# Altium project 1_Interface_QuadUART.PrjPCB
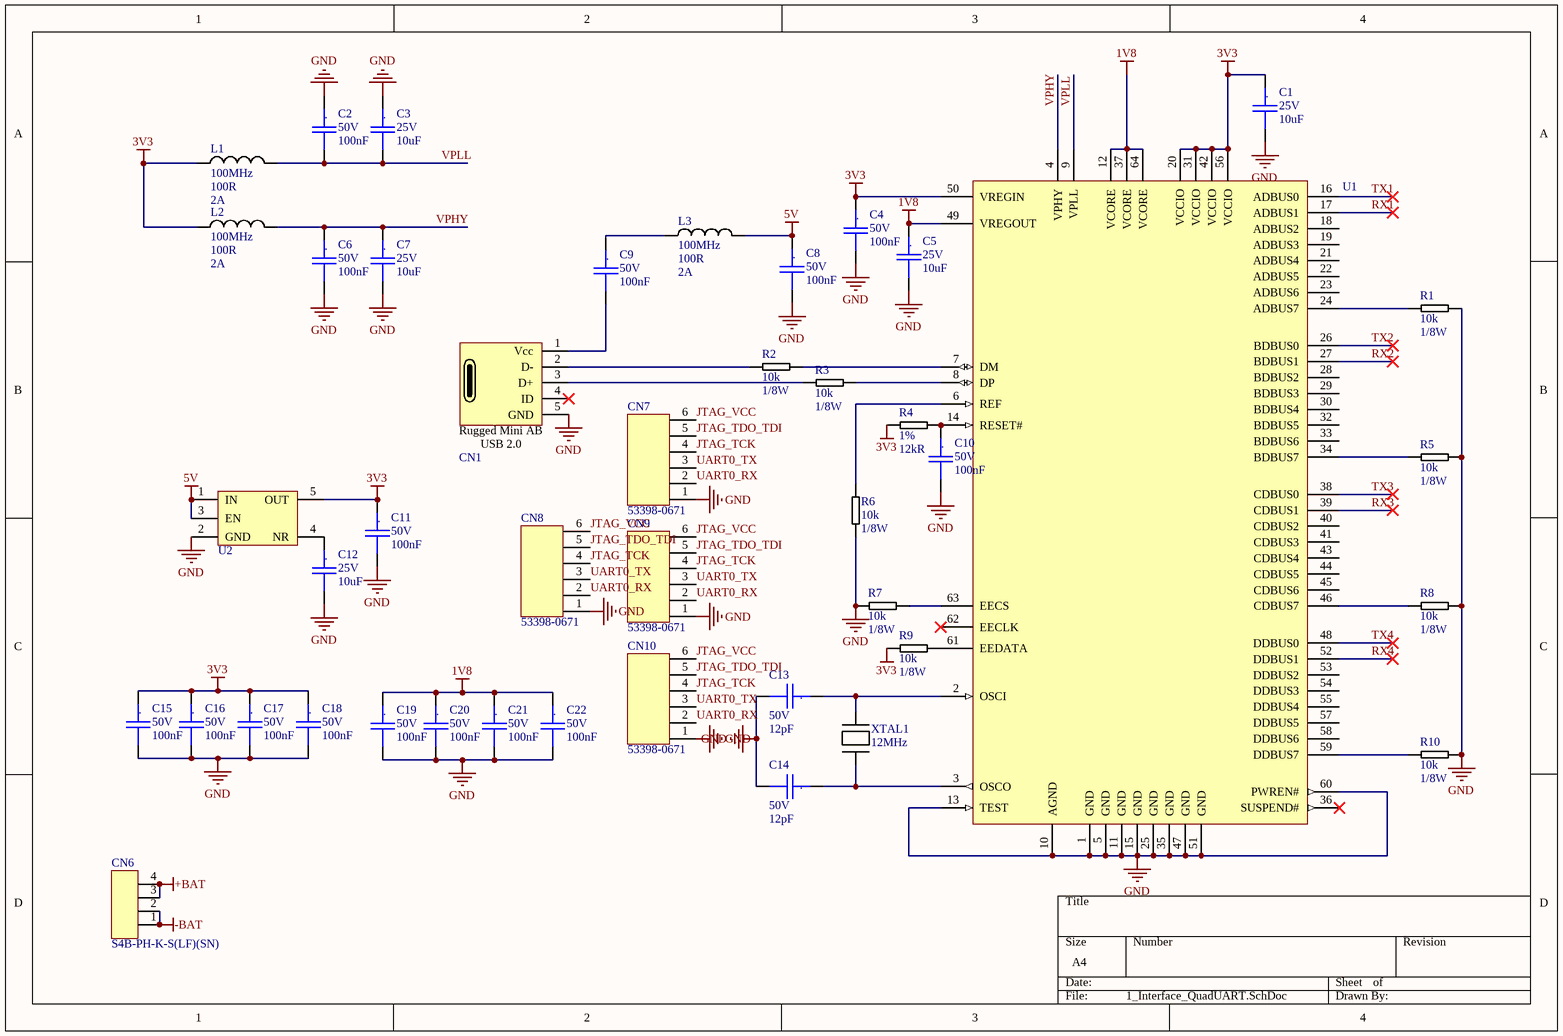
[diagram p0: 1_Interface_QuadUART.SchDoc]
1 sheet, 44 parts. Net scope: global (net labels, ports and power ports of the same name join across sheets).
Board file: 1_Interface_QuadUART.PcbDoc

## Sheet 1_Interface_QuadUART.SchDoc
size A4

### Parts
C1  Voltage: 25V  Capacitance: 10uF  [C1206_MD]  (hidden comment: GRM31CR71E106KA12K)
C2  Voltage Rating: 50V  Capacitance: 100nF  [C0603_MD]  (hidden comment: C1608X7R1H104K080AA)
C3  Voltage: 25V  Capacitance: 10uF  [C1206_MD]  (hidden comment: GRM31CR71E106KA12K)
C4  Voltage Rating: 50V  Capacitance: 100nF  [C0603_MD]  (hidden comment: C1608X7R1H104K080AA)
C5  Voltage: 25V  Capacitance: 10uF  [C1206_MD]  (hidden comment: GRM31CR71E106KA12K)
C6  Voltage Rating: 50V  Capacitance: 100nF  [C0603_MD]  (hidden comment: C1608X7R1H104K080AA)
C7  Voltage: 25V  Capacitance: 10uF  [C1206_MD]  (hidden comment: GRM31CR71E106KA12K)
C8  Voltage Rating: 50V  Capacitance: 100nF  [C0603_MD]  (hidden comment: C1608X7R1H104K080AA)
C9  Voltage Rating: 50V  Capacitance: 100nF  [C0603_MD]  (hidden comment: C1608X7R1H104K080AA)
C10  Voltage Rating: 50V  Capacitance: 100nF  [C0603_MD]  (hidden comment: C1608X7R1H104K080AA)
C11  Voltage Rating: 50V  Capacitance: 100nF  [C0603_MD]  (hidden comment: C1608X7R1H104K080AA)
C12  Voltage: 25V  Capacitance: 10uF  [C1206_MD]  (hidden comment: GRM31CR71E106KA12K)
C13  Voltage: 50V  Capacitance: 12pF  [C0603_MD]  (hidden comment: CL10C120JB8NNNC)
C14  Voltage: 50V  Capacitance: 12pF  [C0603_MD]  (hidden comment: CL10C120JB8NNNC)
C15  Voltage Rating: 50V  Capacitance: 100nF  [C0603_MD]  (hidden comment: C1608X7R1H104K080AA)
C16  Voltage Rating: 50V  Capacitance: 100nF  [C0603_MD]  (hidden comment: C1608X7R1H104K080AA)
C17  Voltage Rating: 50V  Capacitance: 100nF  [C0603_MD]  (hidden comment: C1608X7R1H104K080AA)
C18  Voltage Rating: 50V  Capacitance: 100nF  [C0603_MD]  (hidden comment: C1608X7R1H104K080AA)
C19  Voltage Rating: 50V  Capacitance: 100nF  [C0603_MD]  (hidden comment: C1608X7R1H104K080AA)
C20  Voltage Rating: 50V  Capacitance: 100nF  [C0603_MD]  (hidden comment: C1608X7R1H104K080AA)
C21  Voltage Rating: 50V  Capacitance: 100nF  [C0603_MD]  (hidden comment: C1608X7R1H104K080AA)
C22  Voltage Rating: 50V  Capacitance: 100nF  [C0603_MD]  (hidden comment: C1608X7R1H104K080AA)
CN1  MUSBR-E551-30  [RUGGED USB MINI AB VERTICAL]  (value not drawn)
CN6  S4B-PH-K-S(LF)(SN)  [CONN HEADER R/A 4POS 2MM]
CN7  53398-0671  [PICO BLADE 0533980671]
CN8  53398-0671  [PICO BLADE 0533980671]
CN9  53398-0671  [PICO BLADE 0533980671]
CN10  53398-0671  [PICO BLADE 0533980671]
L1  Test Frequency: 100MHz  Impedance: 100R  Current Rating: 2A  [L0603]  (hidden comment: BLM18EG101TN1D)
L2  Test Frequency: 100MHz  Impedance: 100R  Current Rating: 2A  [L0603]  (hidden comment: BLM18EG101TN1D)
L3  Test Frequency: 100MHz  Impedance: 100R  Current Rating: 2A  [L0603]  (hidden comment: BLM18EG101TN1D)
R1  value 10k  Power: 1/8W  [R0805_MD]  (hidden comment: CRCW080510K0FKEA)
R2  value 10k  Power: 1/8W  [R0805_MD]  (hidden comment: CRCW080510K0FKEA)
R3  value 10k  Power: 1/8W  [R0805_MD]  (hidden comment: CRCW080510K0FKEA)
R4  Tolerance: 1%  Resistance: 12kR  [R0805_MD]  (hidden comment: RMCF0805FT12K0)
R5  value 10k  Power: 1/8W  [R0805_MD]  (hidden comment: CRCW080510K0FKEA)
R6  value 10k  Power: 1/8W  [R0805_MD]  (hidden comment: CRCW080510K0FKEA)
R7  value 10k  Power: 1/8W  [R0805_MD]  (hidden comment: CRCW080510K0FKEA)
R8  value 10k  Power: 1/8W  [R0805_MD]  (hidden comment: CRCW080510K0FKEA)
R9  value 10k  Power: 1/8W  [R0805_MD]  (hidden comment: CRCW080510K0FKEA)
R10  value 10k  Power: 1/8W  [R0805_MD]  (hidden comment: CRCW080510K0FKEA)
U1  IC USB HS QUAD UART  [LQFP-64]  (value not drawn)
U2  TPS79333DBVR  [SOT23-5]  (value not drawn)
XTAL1  Frequency: 12MHz  [TXC 7A Series]  (hidden comment: AA-12.000MAGE-T)

### Nets
1V8: C5.1 C19.1 C20.1 C21.1 C22.1 U1.12(VCORE) U1.37(VCORE) U1.49(VREGOUT) U1.64(VCORE)
3V3: C1.1 C4.1 C11.1 C15.1 C16.1 C17.1 C18.1 L1.1 L2.1 R4.1 R9.1 U1.20(VCCIO) U1.31(VCCIO) U1.42(VCCIO) U1.50(VREGIN) U1.56(VCCIO) U2.5(OUT)
5V: C8.1 L3.2 U2.1(IN) U2.3(EN)
+BAT: CN6.3 CN6.4
-BAT: CN6.1 CN6.2
GND: C1.2 C2.1 C3.1 C4.2 C5.2 C6.2 C7.2 C8.2 C10.2 C11.2 C12.2 C13.2 C14.2 C15.2 C16.2 C17.2 C18.2 C19.2 C20.2 C21.2 C22.2 CN1.5(GND) CN7.1 CN8.1 CN9.1 CN10.1 R1.2 R5.2 R6.1 R7.1 R8.2 R10.2 U1.1(GND) U1.5(GND) U1.10(AGND) U1.11(GND) U1.13(TEST) U1.15(GND) U1.25(GND) U1.35(GND) U1.47(GND) U1.51(GND) U1.60(PWREN#) U2.2(GND)
JTAG_TCK: CN7.4 CN8.4 CN9.4 CN10.4
JTAG_TDO_TDI: CN7.5 CN8.5 CN9.5 CN10.5
JTAG_VCC: CN7.6 CN8.6 CN9.6 CN10.6
RX1: U1.17(ADBUS1)
RX2: U1.27(BDBUS1)
RX3: U1.39(CDBUS1)
RX4: U1.52(DDBUS1)
TX1: U1.16(ADBUS0)
TX2: U1.26(BDBUS0)
TX3: U1.38(CDBUS0)
TX4: U1.48(DDBUS0)
UART0_RX: CN7.2 CN8.2 CN9.2 CN10.2
UART0_TX: CN7.3 CN8.3 CN9.3 CN10.3
VPHY: C6.1 C7.1 L2.2 U1.4(VPHY)
VPLL: C2.2 C3.2 L1.2 U1.9(VPLL)
NetC9_1: C9.1 L3.1
NetC9_2: C9.2 CN1.1(Vcc)
NetC10_1: C10.1 R4.2 U1.14(RESET#)
NetC12_1: C12.1 U2.4(NR)
NetC13_1: C13.1 U1.2(OSCI) XTAL1.1
NetC14_1: C14.1 U1.3(OSCO) XTAL1.2
NetCN1_2: CN1.2(D-) R2.1
NetCN1_3: CN1.3(D+) R3.1
NetR1_1: R1.1 U1.24(ADBUS7)
NetR2_2: R2.2 U1.7(DM)
NetR3_2: R3.2 U1.8(DP)
NetR5_1: R5.1 U1.34(BDBUS7)
NetR6_2: R6.2 U1.6(REF)
NetR7_2: R7.2 U1.63(EECS)
NetR8_1: R8.1 U1.46(CDBUS7)
NetR9_2: R9.2 U1.61(EEDATA)
NetR10_1: R10.1 U1.59(DDBUS7)

Not connected (* = marked no-connect by the designer): CN1 4(ID)*; U1 18(ADBUS2) 19(ADBUS3) 21(ADBUS4) 22(ADBUS5) 23(ADBUS6) 28(BDBUS2) 29(BDBUS3) 30(BDBUS4) 32(BDBUS5) 33(BDBUS6) 36(SUSPEND#)* 40(CDBUS2) 41(CDBUS3) 43(CDBUS4) 44(CDBUS5) 45(CDBUS6) 53(DDBUS2) 54(DDBUS3) 55(DDBUS4) 57(DDBUS5) 58(DDBUS6) 62(EECLK)*

### Notes on the sheet
- (in symbol C1608X7R1H104K080AA) .
- (in symbol CL10C120JB8NNNC) .
- (in symbol GRM31CR71E106KA12K) .
- (in symbol MUSBR-E551-30) Rugged Mini AB; USB 2.0

### Library data of the parts
C1 C3 C5 C7 C12 = GRM31CR71E106KA12K: CAP CER 10UF 25V X7R 1206; Manufacturer: Murata; Tolerance: 10%; Supplier 1: Digi-Key; Supplier Part Number 1: 490-14678-1-ND; Stock 1: 11567; Pricing 1: 1=0.88, 10=0.652, 100=0.4469, 500=0.35378, 1000=0.29792, 2500=0.2793 (USD); Mount: Surface Mount; Case/Package: 1206; Min Operating Temperature: -55°C; Max Operating Temperature: 125°C; Packaging: Tape and Reel; Voltage Rating: 25V; Dielectric: X7R; Voltage Rating (DC): 25V; Length: 0.126inch; Width: 0.063inch; Thickness: 0.071inch; Lead Free: Lead Free; ComponentLink1URL: https://www.murata.com/~/media/webrenewal/support/library/catalog/products/capacitor/mlcc/c02e.ashx?la=en-us&src-supplier=Digi-Key; ComponentLink1Description: https://www.murata.com/~/media/webrenewal/support/library/catalog/products/capacitor/mlcc/c02e.ashx?la=en-us&src-supplier=Digi-Key; ComponentLink2URL: https://search.murata.co.jp/Ceramy/image/img/A01X/G101/ENG/GRM31CR71E106KA12-01.pdf?src-supplier=Digi-Key; ComponentLink2Description: https://search.murata.co.jp/Ceramy/image/img/A01X/G101/ENG/GRM31CR71E106KA12-01.pdf?src-supplier=Digi-Key; Supplier 2: Mouser; Supplier Part Number 2: 81-GRM31CR71E106KA2K; Stock 2: 5051; Pricing 2: 1=0.88, 10=0.652, 100=0.446, 250=0.446, 500=0.353, 1000=0.297 (USD); Manufacturer Part Number: GRM31CR71E106KA12K
C2 C4 C6 C8-C11 C15-C22 = C1608X7R1H104K080AA: TDK - C1608X7R1H104K080AA - SMD Multilayer Ceramic Capacitor, 0.1 µF, 50 V, 0603 [1608 Metric], ± 10%, X7R, C Series; Supplier 1: Digi-Key; Supplier Part Number 1: 445-1314-1-ND; Manufacturer: TDK; Stock 1: 513759; Pricing 1: 1=0.12, 10=0.088, 100=0.0413, 500=0.02896, 1000=0.02397 (USD); Mount: Surface Mount; Case/Package: 0603; Number of Pins: 2; Weight: 7.1E-05oz; Case Code (Imperial): 0603; Case Code (Metric): 1608; Dielectric Material: Ceramic; Min Operating Temperature: -55°C; Max Operating Temperature: 125°C; Tolerance: 10%; Dielectric: X7R; Packaging: Tape and Reel; Package Quantity: 1; Termination: SMD/SMT; Voltage: 50V; Voltage Rating (DC): 50V; Composition: Ceramic; Length: 1.6mm; Height: 0.8mm; Depth: 0.8mm; Width: 0.8mm; Thickness: 0.037inch; Radiation Hardening: No; REACH SVHC: No SVHC; Lead Free: Lead Free; ComponentLink1URL: https://product.tdk.com/info/en/catalog/spec/mlccspec_commercial_general_midvoltage_en.pdf?src-supplier=Digi-Key; ComponentLink1Description: https://product.tdk.com/info/en/catalog/spec/mlccspec_commercial_general_midvoltage_en.pdf?src-supplier=Digi-Key; ComponentLink2URL: http://uk.rs-online.com/webdocs/13d1/0900766b813d1103.pdf?src-supplier=RSComponents; ComponentLink2Description: http://uk.rs-online.com/webdocs/13d1/0900766b813d1103.pdf?src-supplier=RSComponents; ComponentLink3URL: http://www.tdk.co.jp/tefe02/e412_c.pdf?src-supplier=Avnet+Europe; ComponentLink3Description: http://www.tdk.co.jp/tefe02/e412_c.pdf?src-supplier=Avnet+Europe; ComponentLink4URL: http://www.farnell.com/datasheets/2792994.pdf?src-supplier=Farnell; ComponentLink4Description: http://www.farnell.com/datasheets/2792994.pdf?src-supplier=Farnell; ComponentLink5URL: http://www.farnell.com/datasheets/1744655.pdf?src-supplier=Element14; ComponentLink5Description: http://www.farnell.com/datasheets/1744655.pdf?src-supplier=Element14; Supplier 2: Mouser; Supplier Part Number 2: 810-C1608X7R1H104K; Stock 2: 34512; Pricing 2: 1=0.12, 10=0.088, 100=0.041, 500=0.029, 1000=0.024, 4000=0.017, 8000=0.016, 24000=0.013, 48000=0.011 (USD); Manufacturer Part Number: C1608X7R1H104K080AA
C13 C14 = CL10C120JB8NNNC: Cap Ceramic 12pF 50VDC C0G 5% SMD 0603 Paper T/R; Manufacturer: Samsung; Temperature Coefficient: 300ppm/°C; Supplier 1: Digi-Key; Supplier Part Number 1: 1276-1254-1-ND; Stock 1: 64675; Pricing 1: 1=0.1, 10=0.045, 100=0.0201, 500=0.01436, 1000=0.01128 (USD); Mount: Surface Mount; Case/Package: 0603; Case Code (Metric): 1608; Case Code (Imperial): 0603; Material: Ceramic; Contact Plating: Tin; Min Operating Temperature: -55°C; Max Operating Temperature: 125°C; Dielectric: C0G; Voltage Rating (DC): 50V; Voltage Rating: 50V; Package Quantity: 1; Packaging: Tape and Reel; Length: 1.6mm; Height: 0.8mm; Depth: 0.8mm; Width: 0.031inch; Thickness: 0.035inch; Radiation Hardening: No; Lead Free: Lead Free; ComponentLink1URL: https://media.digikey.com/pdf/Data%20Sheets/Samsung%20PDFs/CL_Series_MLCC_ds.pdf?src-supplier=Digi-Key; ComponentLink1Description: https://media.digikey.com/pdf/Data%20Sheets/Samsung%20PDFs/CL_Series_MLCC_ds.pdf?src-supplier=Digi-Key; ComponentLink2URL: https://www.verical.com/server-webapp/html/getDatasheet?partID=640658&src-supplier=Verical; ComponentLink2Description: https://www.verical.com/server-webapp/html/getDatasheet?partID=640658&src-supplier=Verical; ComponentLink3URL: https://produktinfo.conrad.com/datenblaetter/450000-474999/457317-da-01-en-VS_KONDENSATOR_0603.pdf?src-supplier=Conrad; ComponentLink3Description: https://produktinfo.conrad.com/datenblaetter/450000-474999/457317-da-01-en-VS_KONDENSATOR_0603.pdf?src-supplier=Conrad; Manufacturer Part Number: CL10C120JB8NNNC; Tolerance: 5%
CN1 = MUSBR-E551-30: RUGGED USB MINI AB VERTICAL; Manufacturer: Amphenol Commercial; Number of Contacts: 5; Gender: Receptacle; Ratings: IP67,Waterproof,Dust Tight; Supplier 1: Digi-Key; Supplier Part Number 1: MUSBR-E551-30-ND; Stock 1: 160; Pricing 1: 1=10.83, 10=9.846, 25=9.6, 50=8.8614, 100=8.3691, 250=7.63064, 500=7.13836, 1000=7.111 (USD); Mount: Through Hole,Vertical; Packaging: Tray; Connector Type: USB; Features: Shielded; ComponentLink1URL: https://www.amphenolcanada.com/ProductSearch/Drawings/AC/MUSBRE551XX.pdf?src-supplier=Digi-Key; ComponentLink1Description: https://www.amphenolcanada.com/ProductSearch/Drawings/AC/MUSBRE551XX.pdf?src-supplier=Digi-Key; Supplier 2: Mouser; Supplier Part Number 2: 523-MUSBR-E551-30; Stock 2: 65; Pricing 2: 1=10.83, 10=9.84, 25=8.86, 100=8.36, 250=7.81, 500=7.81 (USD); Manufacturer Part Number: MUSBR-E551-30
CN6 = S4B-PH-K-S(LF)(SN): JST (JAPAN SOLDERLESS TERMINALS) - S4B-PH-K-S (LF)(SN) - CONNECTOR, HEADER, 2MM, 4 POSITION, 1ROW; Current Rating: 2A; Number of Poles: 4; Contact Resistance: 10mR; Voltage Rating (AC): 100V; Insulation Resistance: 1GR; Gender: Male; Connector Type: Male Pin; Supplier 1: Digi-Key; Supplier Part Number 1: 455-1721-ND; Manufacturer: JST; Stock 1: 71034; Pricing 1: 1=0.22, 10=0.208, 100=0.144, 500=0.12186, 1000=0.0997, 5000=0.08862, 10000=0.08031 (USD); Mount: Through Hole; Number of Pins: 4; Contact Material: Tin,Brass,Bronze; Contact Plating: Tin; Color: Natural,White; Housing Color: Natural; Min Operating Temperature: -25°C; Max Operating Temperature: 85°C; Number of Rows: 1; Voltage Rating: 100V; Packaging: Bulk; Number of Positions: 4; Termination: Solder; Fastening Type: Detent; Number of Contacts: 4; Working Voltage: 100V; Orientation: Right Angle; Length: 9.9mm; Height: 9.4mm; Width: 4.5mm; Pitch: 2mm; Lead Pitch: 2mm; Contact Mating Length: 0.13inch; REACH SVHC: No SVHC; Lead Free: Lead Free; Flammability Rating: UL94 V-0; ComponentLink1URL: http://www.jst-mfg.com/product/pdf/eng/ePH.pdf?src-supplier=Digi-Key; ComponentLink1Description: http://www.jst-mfg.com/product/pdf/eng/ePH.pdf?src-supplier=Digi-Key; Manufacturer Part Number: S4B-PH-K-S(LF)(SN)
CN7-CN10 = 53398-0671: 1.25mm Pitch PicoBlade™ Header, Surface Mount, Vertical, 6 Circuits; Manufacturer: Molex; Body Plating: Tin; Contact Resistance: 20mR; Voltage Rating: 125V; Current Rating: 1A; Number of Positions: 6; Insulation Resistance: 100MR; Gender: Male; Glow Wire Compliant: Non-compliant; Supplier 1: Digi-Key; Supplier Part Number 1: WM7610DKR-ND; Stock 1: 21086; Pricing 1: 1=1.39, 10=1.26, 100=1.0802, 500=0.90014 (USD); Mount: Surface Mount; Color: Natural; Contact Plating: Tin; Contact Material: Bronze,Tin; Housing Color: Natural; Housing Material: Nylon; Min Operating Temperature: -40°C; Max Operating Temperature: 85°C; Packaging: Tape and Reel; Number of Rows: 1; Voltage Rating (AC): 125V; Package Quantity: 1000; Termination: Solder; Number of Contacts: 6; Working Voltage: 125V; Orientation: Vertical; Number of Circuits: 6; Voltage Rating (DC): 125V; Lead Pitch: 1.25mm; Pitch: 1.25mm; Radiation Hardening: No; REACH SVHC: Unknown; Lead Free: Lead Free; Flammability Rating: UL94 V-0; ComponentLink1URL: https://www.molex.com/pdm_docs/sd/533980671_sd.pdf?src-supplier=Digi-Key; ComponentLink1Description: https://www.molex.com/pdm_docs/sd/533980671_sd.pdf?src-supplier=Digi-Key; Supplier 2: Mouser; Supplier Part Number 2: 538-53398-0671; Stock 2: 26; Pricing 2: 1=1.15, 10=1.01, 100=0.864, 500=0.727, 1000=0.427, 2000=0.374 (USD); Manufacturer Part Number: 53398-0671
L1-L3 = BLM18EG101TN1D: FERRITE BEAD 100 OHM 0603 1LN; Manufacturer: Murata; Material: Ferrite,Steel; Tolerance: 25%; DC Resistance (DCR): 45mR; Number of Lines: 1; Supplier 1: Digi-Key; Supplier Part Number 1: 490-5978-1-ND; Stock 1: 64347; Pricing 1: 1=0.23, 10=0.175, 25=0.1452, 50=0.1252, 100=0.1126, 250=0.09508, 500=0.08508, 1000=0.07257 (USD); Case/Package: 0603; Number of Pins: 2; Core Material: Ferrite; Case Code (Metric): 1608; Case Code (Imperial): 0603; Contact Plating: Tin,Matte; Min Operating Temperature: -55°C; Max Operating Temperature: 125°C; Max DC Current: 2A; Package Quantity: 1; Packaging: Tape and Reel; Max Current Rating: 2A; Termination: SMD/SMT; Number of Circuits: 1; Length: 1.6mm; Height: 0.8mm; Depth: 0.8mm; Width: 0.8mm; REACH SVHC: No SVHC; Lead Free: Lead Free; ComponentLink1URL: https://www.murata.com/en-global/products/productdata/8796733767710/S0580E.pdf?src-supplier=Digi-Key; ComponentLink1Description: https://www.murata.com/en-global/products/productdata/8796733767710/S0580E.pdf?src-supplier=Digi-Key; ComponentLink2URL: http://www.murata.com/products/catalog/pdf/c31e.pdf?src-supplier=Element14; ComponentLink2Description: http://www.murata.com/products/catalog/pdf/c31e.pdf?src-supplier=Element14; ComponentLink3URL: http://search.murata.co.jp/Ceramy/image/img/PDF/ENG/L0110S0101BLM18E.pdf?src-supplier=Avnet; ComponentLink3Description: http://search.murata.co.jp/Ceramy/image/img/PDF/ENG/L0110S0101BLM18E.pdf?src-supplier=Avnet; ComponentLink4URL: http://search.murata.co.jp/Ceramy/image/img/PDF/ENG/L0110S0101BLM18E.pdf?src-supplier=Avnet+Europe; ComponentLink4Description: http://search.murata.co.jp/Ceramy/image/img/PDF/ENG/L0110S0101BLM18E.pdf?src-supplier=Avnet+Europe; ComponentLink5URL: http://search.murata.co.jp/Ceramy/image/img/PDF/ENG/L0110S0101BLM18E.pdf?src-supplier=Future+Electronics; ComponentLink5Description: http://search.murata.co.jp/Ceramy/image/img/PDF/ENG/L0110S0101BLM18E.pdf?src-supplier=Future+Electronics; ComponentLink6URL: http://uk.rs-online.com/webdocs/11b5/0900766b811b5866.pdf?src-supplier=RSComponents; ComponentLink6Description: http://uk.rs-online.com/webdocs/11b5/0900766b811b5866.pdf?src-supplier=RSComponents; ComponentLink7URL: http://www.produktinfo.conrad.com/datenblaetter/1100000-1199999/001172263-da-01-en-DROSSEL_0603_100R_1_6X0_8MM_4000ST.pdf?src-supplier=Conrad; ComponentLink7Description: http://www.produktinfo.conrad.com/datenblaetter/1100000-1199999/001172263-da-01-en-DROSSEL_0603_100R_1_6X0_8MM_4000ST.pdf?src-supplier=Conrad; ComponentLink8URL: http://www.produktinfo.conrad.com/datenblaetter/1100000-1199999/001171697-da-01-en-CHIP_DROSSEL0603_100R_2000MA_1_6X0_8MM.pdf?src-supplier=Conrad; ComponentLink8Description: http://www.produktinfo.conrad.com/datenblaetter/1100000-1199999/001171697-da-01-en-CHIP_DROSSEL0603_100R_2000MA_1_6X0_8MM.pdf?src-supplier=Conrad; Supplier 2: Mouser; Supplier Part Number 2: 81-BLM18EG101TN1D; Stock 2: 10695; Pricing 2: 1=0.22, 10=0.125, 100=0.095, 500=0.081, 1000=0.072, 4000=0.063 (USD); Manufacturer Part Number: BLM18EG101TN1D
R1-R3 R5-R10 = CRCW080510K0FKEA: RES 10.0K OHM 1/8W 1% 0805 SMD; Manufacturer: Vishay Dale; Resistance: 10kR; Temperature Coefficient: 100ppm/°C; Power Rating: 125mW; Voltage Rating: 150V; Mount Type: SMD; Tolerance: 1%; Supplier 1: Newark; Supplier 2: Mouser; Supplier 3: Digi-Key; Supplier 4: Allied; Supplier 5: Farnell; Supplier Part Number 1: 52K9795; Supplier Part Number 2: 71-CRCW0805-10K-E3; Supplier Part Number 3: 541-10.0KCCT-ND; Supplier Part Number 4: 70201192; Supplier Part Number 5: 1632457; Supplier 6: Digi-Key; Supplier Part Number 6: 541-10.0KCDKR-ND; Stock 6: 1354479; Pricing 6: 1=0.1, 10=0.062, 100=0.0254, 1000=0.01142, 2500=0.00991 (USD); Case/Package: 0805; Weight: 0.000194oz; Contact Plating: Tin; Case Code (Imperial): 0805; Case Code (Metric): 2012; Min Operating Temperature: -55°C; Max Operating Temperature: 155°C; Composition: Thick Film; Packaging: Tape and Reel; Package Quantity: 5000; Military Standard: Not; Termination: SMD/SMT; Voltage Rating (DC): 150V; Length: 2mm; Height: 0.45mm; Width: 1.25mm; Depth: 1.25mm; Radiation Hardening: No; Lead Free: Lead Free; REACH SVHC: Unknown; ComponentLink1URL: http://www.mouser.com/ds/2/427/dcrcwe3-109170.pdf?src-supplier=Mouser; ComponentLink1Description: http://www.mouser.com/ds/2/427/dcrcwe3-109170.pdf?src-supplier=Mouser; ComponentLink2URL: http://uk.rs-online.com/webdocs/0d98/0900766b80d98b26.pdf?src-supplier=RSComponents; ComponentLink2Description: http://uk.rs-online.com/webdocs/0d98/0900766b80d98b26.pdf?src-supplier=RSComponents; ComponentLink3URL: http://www.alliedelec.com/m/d/0c934d6939ccefa68dbe0b96d821c8cf.pdf?src-supplier=Allied+Electronics; ComponentLink3Description: http://www.alliedelec.com/m/d/0c934d6939ccefa68dbe0b96d821c8cf.pdf?src-supplier=Allied+Electronics; ComponentLink4URL: http://www.vishay.com/docs/20035/dcrcwe3.pdf?src-supplier=Avnet+Asia; ComponentLink4Description: http://www.vishay.com/docs/20035/dcrcwe3.pdf?src-supplier=Avnet+Asia; ComponentLink5URL: http://www.vishay.com/docs/20035/dcrcwe3.pdf?src-supplier=Avnet+Europe; ComponentLink5Description: http://www.vishay.com/docs/20035/dcrcwe3.pdf?src-supplier=Avnet+Europe; ComponentLink6URL: http://www.farnell.com/datasheets/2310790.pdf?src-supplier=Element14; ComponentLink6Description: http://www.farnell.com/datasheets/2310790.pdf?src-supplier=Element14; ComponentLink7URL: http://www.vishay.com/docs/20035/dcrcwe3.pdf?src-supplier=Avnet; ComponentLink7Description: http://www.vishay.com/docs/20035/dcrcwe3.pdf?src-supplier=Avnet; ComponentLink8URL: http://www.vishay.com/docs/20035/dcrcwe3.pdf?src-supplier=Future+Electronics; ComponentLink8Description: http://www.vishay.com/docs/20035/dcrcwe3.pdf?src-supplier=Future+Electronics; Stock 2: 101022; Pricing 2: 1=0.1, 10=0.062, 100=0.025, 1000=0.01, 5000=0.007, 10000=0.006, 25000=0.005 (USD); Manufacturer Part Number: CRCW080510K0FKEA
R4 = RMCF0805FT12K0: Resistor, SMT, 0805, 12K Ohm, +/-1%, +/-100ppm, Thk Film, T/R Marked; Manufacturer: Stackpole Electronics; Power Rating: 125mW; Temperature Coefficient: 100ppm/°C; Supplier 1: Digi-Key; Supplier Part Number 1: RMCF0805FT12K0CT-ND; Stock 1: 30304; Pricing 1: 1=0.1, 10=0.026, 100=0.0104, 1000=0.00466, 2500=0.00405 (USD); Mount: Surface Mount; Case/Package: 0805; Case Code (Metric): 2012; Case Code (Imperial): 0805; Contact Plating: Tin,Matte; Min Operating Temperature: -55°C; Max Operating Temperature: 155°C; Packaging: Tape and Reel; Composition: Thick Film; Number of Terminations: 2; Max Power Dissipation: 125mW; Features: Automotive AEC-Q200; Length: 0.079inch; Height: 0.026inch; Width: 0.049inch; Radiation Hardening: No; Lead Free: Lead Free; ComponentLink1URL: https://www.seielect.com/catalog/SEI-RMCF_RMCP.pdf?src-supplier=Avnet; ComponentLink1Description: https://www.seielect.com/catalog/SEI-RMCF_RMCP.pdf?src-supplier=Avnet; ComponentLink2URL: https://www.seielect.com/Catalog/SEI-RMCF_RMCP.pdf?src-supplier=Digi-Key; ComponentLink2Description: https://www.seielect.com/Catalog/SEI-RMCF_RMCP.pdf?src-supplier=Digi-Key; ComponentLink3URL: https://www.seielect.com/catalog/SEI-Packaging.pdf?src-supplier=Digi-Key; ComponentLink3Description: https://www.seielect.com/catalog/SEI-Packaging.pdf?src-supplier=Digi-Key; ComponentLink4URL: http://seielect.com/Catalog/SEI-RMCF_RMCP.pdf?src-supplier=Future+Electronics; ComponentLink4Description: http://seielect.com/Catalog/SEI-RMCF_RMCP.pdf?src-supplier=Future+Electronics; ComponentLink5URL: http://components.arrow.com/part/dataview/40964023S7542466N1174?src-supplier=Arrow; ComponentLink5Description: http://components.arrow.com/part/dataview/40964023S7542466N1174?src-supplier=Arrow; Manufacturer Part Number: RMCF0805FT12K0
U1 = FT4232HL-REEL: FTDI - FT4232HL-REEL - USB-UART/MPSSE, 4232, QUAD, 64LQFP; Number of Channels: 1; Data Rate: 480Mbps; Operating Supply Voltage: 3.3V; Max Supply Voltage: 3.63V; Min Supply Voltage: 1.62V; Operating Supply Current: 70mA; Number of Transceivers: 4; ESD Protection: Yes; Supplier 1: Digi-Key; Supplier Part Number 1: 768-1026-1-ND; Manufacturer: FTDI; Stock 1: 18748; Pricing 1: 1=8.3, 10=8.09, 50=7.46, 100=7.14, 500=6.88006 (USD); Mount: Surface Mount; Case/Package: LQFP; Number of Pins: 64; Weight: 0.012088oz; Min Operating Temperature: -40°C; Max Operating Temperature: 85°C; Packaging: Tape and Reel; Package Quantity: 1000; Dual Supply Voltage: 3.3V; Interface: UART; Length: 10.1mm; Height: 1.4mm; Width: 10.1mm; Radiation Hardening: No; Lead Free: Lead Free; ComponentLink1URL: http://www.ftdichip.com/Support/Documents/AppNotes/AN_128_User_Guide_For_FT4232H_Factory%20test%20utility.pdf?src-supplier=Digi-Key; ComponentLink1Description: http://www.ftdichip.com/Support/Documents/AppNotes/AN_128_User_Guide_For_FT4232H_Factory%20test%20utility.pdf?src-supplier=Digi-Key; ComponentLink2URL: http://www.alliedelec.com/images/products/datasheets/bm/FTDI/70403916.pdf?src-supplier=Allied+Electronics; ComponentLink2Description: http://www.alliedelec.com/images/products/datasheets/bm/FTDI/70403916.pdf?src-supplier=Allied+Electronics; ComponentLink3URL: http://www.ftdichip.com/Support/Documents/DataSheets/ICs/DS_FT4232H.pdf?src-supplier=Future+Electronics; ComponentLink3Description: http://www.ftdichip.com/Support/Documents/DataSheets/ICs/DS_FT4232H.pdf?src-supplier=Future+Electronics; ComponentLink4URL: https://www.verical.com/server-webapp/html/getDatasheet?partID=643215&src-supplier=Verical; ComponentLink4Description: https://www.verical.com/server-webapp/html/getDatasheet?partID=643215&src-supplier=Verical; ComponentLink5URL: http://datasheet.iiic.cc/ftdi/FT4232HL-REEL.pdf?src-supplier=IIIC; ComponentLink5Description: http://datasheet.iiic.cc/ftdi/FT4232HL-REEL.pdf?src-supplier=IIIC; Supplier 2: Mouser; Supplier Part Number 2: 895-FT4232HL; Stock 2: 21282; Pricing 2: 1=8.3, 25=8.09, 50=7.46, 100=7.14, 500=6.88, 1000=6.08 (USD); Manufacturer Part Number: FT4232HL-REEL
U2 = TPS79333DBVR: TEXAS INSTRUMENTS - TPS79333DBVR - IC, V REG, LINEAR, 0.2A, SOT-23-5; Number of Outputs: 1; Output Voltage: 3.3V; Max Power Dissipation: 560mW; Max Output Current: 200mA; Max Input Voltage: 5.5V; Min Input Voltage: 2.7V; Polarity: Positive; Quiescent Current: 200uA; Accuracy: 2%; Output Type: Fixed; Dropout Voltage: 102mV; Min Current Limit: 285mA; Input Bias Current: 170uA; Supplier 1: Digi-Key; Supplier Part Number 1: 296-12961-1-ND; Manufacturer: Texas Instruments; Stock 1: 21565; Pricing 1: 1=0.73, 10=0.64, 25=0.6016, 100=0.4559, 250=0.388, 500=0.3686, 1000=0.2813 (USD); Case/Package: SOT-23; Number of Pins: 5; Min Operating Temperature: -40°C; Max Operating Temperature: 125°C; Output Current: 200mA; Packaging: Tape and Reel; Package Quantity: 1; Number of Regulators: 1; Min Output Voltage: 3.3V; Power Dissipation: 560mW; Max Output Voltage: 3.3V; Output Voltage Accuracy: 2%; Nominal Output Voltage: 3.3V; Power Rating: 560mW; Max Supply Voltage: 5.5V; Min Supply Voltage: 2.7V; Termination: SMD/SMT; Current Rating: 200mA; Length: 2.9mm; Height: 1.15mm; Width: 1.6mm; Radiation Hardening: No; Lead Free: Lead Free; REACH SVHC: No SVHC; ComponentLink1URL: http://www.ti.com/general/docs/lit/getliterature.tsp?genericPartNumber=TPS793&amp;&amp;fileType=pdf&src-supplier=Farnell; ComponentLink1Description: http://www.ti.com/general/docs/lit/getliterature.tsp?genericPartNumber=TPS793&amp;&amp;fileType=pdf&src-supplier=Farnell; ComponentLink2URL: http://www.jameco.com/Jameco/Products/ProdDS/1123416.pdf?src-supplier=Jameco; ComponentLink2Description: http://www.jameco.com/Jameco/Products/ProdDS/1123416.pdf?src-supplier=Jameco; Supplier 2: Mouser; Supplier Part Number 2: 595-TPS79333DBVR; Stock 2: 31707; Pricing 2: 1=0.72, 10=0.6, 100=0.379, 1000=0.289, 2000=0.282, 3000=0.252, 9000=0.242, 48000=0.233 (USD); Manufacturer Part Number: TPS79333DBVR
XTAL1 = AA-12.000MAGE-T: Crystals 12.000MHz 30ppm 12pF -40C to 85C; Manufacturer: TXC; ESR (Equivalent Series Resistance): 100R; Frequency Stability: 50ppm; Supplier 1: Digi-Key; Supplier Part Number 1: 887-1656-1-ND; Stock 1: 2398; Pricing 1: 1=0.83, 10=0.734, 50=0.6858, 100=0.6061, 500=0.5742 (USD); Mount: Surface Mount; Case/Package: SMD/SMT; Number of Pins: 2; Min Operating Temperature: -40°C; Max Operating Temperature: 85°C; Package Quantity: 1000; Tolerance: 30ppm; Packaging: Tape and Reel; Frequency Tolerance: 30ppm; Termination: SMD/SMT; Length: 0.197inch; Height: 0.053inch; Width: 3.2mm; Ratings: AEC-Q200; REACH SVHC: No SVHC; ComponentLink1URL: http://www.txccrystal.com/images/pdf/number-crystal-automotive.pdf?src-supplier=Digi-Key; ComponentLink1Description: http://www.txccrystal.com/images/pdf/number-crystal-automotive.pdf?src-supplier=Digi-Key; ComponentLink2URL: http://www.farnell.com/datasheets/1811860.pdf?src-supplier=Element14; ComponentLink2Description: http://www.farnell.com/datasheets/1811860.pdf?src-supplier=Element14; Supplier 2: Mouser; Supplier Part Number 2: 717-AA-12.000MAGE-T; Stock 2: 4856; Pricing 2: 1=0.83, 10=0.734, 50=0.685, 100=0.606, 500=0.574, 1000=0.435 (USD); Manufacturer Part Number: AA-12.000MAGE-T